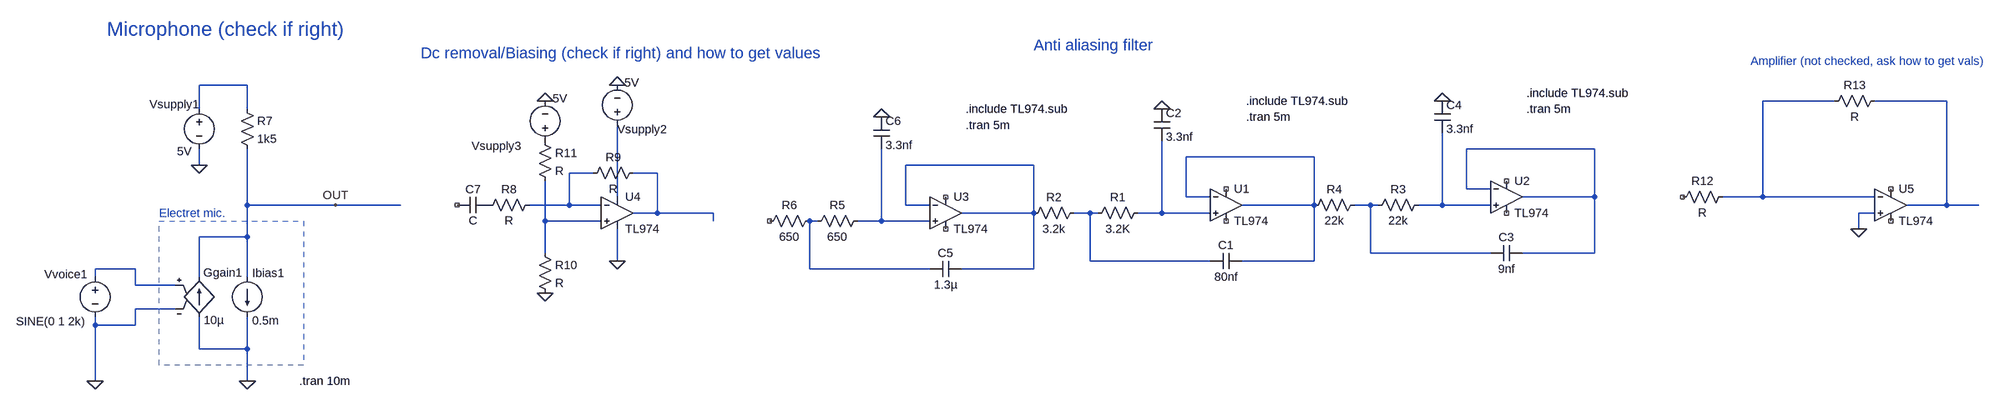
[diagram p0: schematic antialiasing.asc]
antialiasing.asc, the LTspice schematic file:
Version 4
SHEET 1 1660 680
WIRE -1888 -16 -1984 -16
WIRE 1312 16 1168 16
WIRE 1536 16 1392 16
WIRE -1984 32 -1984 -16
WIRE -1888 32 -1888 -16
WIRE 816 112 560 112
WIRE 256 128 0 128
WIRE -1984 144 -1984 112
WIRE -304 144 -560 144
WIRE -1184 160 -1232 160
WIRE -1056 160 -1104 160
WIRE 560 192 560 112
WIRE 608 192 560 192
WIRE -1136 208 -1136 64
WIRE 0 208 0 128
WIRE 48 208 0 208
WIRE 816 208 816 112
WIRE 816 208 672 208
WIRE 1168 208 1168 16
WIRE 1168 208 1088 208
WIRE 1392 208 1168 208
WIRE -1888 224 -1888 112
WIRE -1712 224 -1888 224
WIRE -1568 224 -1712 224
WIRE -1232 224 -1232 160
WIRE -1232 224 -1312 224
WIRE -1168 224 -1232 224
WIRE -560 224 -560 144
WIRE -512 224 -560 224
WIRE 256 224 256 128
WIRE 256 224 112 224
WIRE 368 224 336 224
WIRE 384 224 368 224
WIRE 512 224 512 80
WIRE 512 224 464 224
WIRE 608 224 512 224
WIRE 1536 224 1536 16
WIRE 1536 224 1456 224
WIRE 1600 224 1536 224
WIRE -1056 240 -1056 160
WIRE -1056 240 -1104 240
WIRE -944 240 -1056 240
WIRE -304 240 -304 144
WIRE -304 240 -448 240
WIRE -192 240 -224 240
WIRE -176 240 -192 240
WIRE -48 240 -48 96
WIRE -48 240 -96 240
WIRE 48 240 -48 240
WIRE 1392 240 1360 240
WIRE -1280 256 -1280 176
WIRE -1168 256 -1280 256
WIRE -944 256 -944 240
WIRE -736 256 -752 256
WIRE -608 256 -608 112
WIRE -608 256 -656 256
WIRE -512 256 -608 256
WIRE 1360 272 1360 240
WIRE -1888 288 -1888 224
WIRE -1888 288 -1984 288
WIRE -1280 320 -1280 256
WIRE 368 320 368 224
WIRE 608 320 368 320
WIRE 816 320 816 208
WIRE 816 320 672 320
WIRE -1136 336 -1136 272
WIRE -192 336 -192 240
WIRE 48 336 -192 336
WIRE 256 336 256 224
WIRE 256 336 112 336
WIRE -2112 352 -2192 352
WIRE -752 352 -752 256
WIRE -512 352 -752 352
WIRE -304 352 -304 240
WIRE -304 352 -448 352
WIRE -2192 368 -2192 352
WIRE -1984 368 -1984 288
WIRE -1888 368 -1888 288
WIRE -2112 384 -2112 352
WIRE -2032 384 -2112 384
WIRE -2032 432 -2112 432
WIRE -2192 464 -2192 448
WIRE -2112 464 -2112 432
WIRE -2112 464 -2192 464
WIRE -1984 512 -1984 448
WIRE -1888 512 -1888 448
WIRE -1888 512 -1984 512
WIRE -2192 576 -2192 464
WIRE -1888 576 -1888 512
FLAG -48 32 0
FLAG 512 16 0
FLAG -608 48 0
FLAG -1888 576 0
FLAG -1712 224 OUT
FLAG -2192 576 0
FLAG -1984 144 0
FLAG -1280 400 0
FLAG -1136 336 0
FLAG -1136 -16 0
FLAG -1280 16 0
FLAG 1360 272 0
SYMBOL Opamps\\opamp2 80 160 R0
SYMATTR InstName U1
SYMATTR Value TL974
SYMBOL res -80 224 R90
WINDOW 0 0 56 VBottom 2
WINDOW 3 32 56 VTop 2
SYMATTR InstName R1
SYMATTR Value 3.2K
SYMBOL res -208 224 R90
WINDOW 0 0 56 VBottom 2
WINDOW 3 32 56 VTop 2
SYMATTR InstName R2
SYMATTR Value 3.2k
SYMBOL cap 112 320 R90
WINDOW 0 0 32 VBottom 2
WINDOW 3 32 32 VTop 2
SYMATTR InstName C1
SYMATTR Value 80nf
SYMBOL cap -64 32 R0
SYMATTR InstName C2
SYMATTR Value 3.3nf
SYMBOL Opamps\\opamp2 640 144 R0
SYMATTR InstName U2
SYMATTR Value TL974
SYMBOL res 480 208 R90
WINDOW 0 0 56 VBottom 2
WINDOW 3 32 56 VTop 2
SYMATTR InstName R3
SYMATTR Value 22k
SYMBOL res 352 208 R90
WINDOW 0 0 56 VBottom 2
WINDOW 3 32 56 VTop 2
SYMATTR InstName R4
SYMATTR Value 22k
SYMBOL cap 672 304 R90
WINDOW 0 0 32 VBottom 2
WINDOW 3 32 32 VTop 2
SYMATTR InstName C3
SYMATTR Value 9nf
SYMBOL cap 496 16 R0
SYMATTR InstName C4
SYMATTR Value 3.3nf
SYMBOL Opamps\\opamp2 -480 176 R0
SYMATTR InstName U3
SYMATTR Value TL974
SYMBOL res -640 240 R90
WINDOW 0 0 56 VBottom 2
WINDOW 3 32 56 VTop 2
SYMATTR InstName R5
SYMATTR Value 650
SYMBOL cap -448 336 R90
WINDOW 0 0 32 VBottom 2
WINDOW 3 32 32 VTop 2
SYMATTR InstName C5
SYMATTR Value 1.3µ
SYMBOL cap -624 48 R0
SYMATTR InstName C6
SYMATTR Value 3.3nf
SYMBOL res -736 240 R90
WINDOW 0 0 56 VBottom 2
WINDOW 3 32 56 VTop 2
SYMATTR InstName R6
SYMATTR Value 650
SYMBOL g -1984 352 R0
WINDOW 0 8 7 Left 2
WINDOW 3 9 102 Left 2
SYMATTR InstName Ggain1
SYMATTR Value 10µ
SYMBOL current -1888 368 R0
WINDOW 0 10 -8 Left 2
WINDOW 3 10 87 Left 2
WINDOW 123 0 0 Left 0
WINDOW 39 0 0 Left 0
SYMATTR InstName Ibias1
SYMATTR Value 0.5m
SYMBOL res -1904 16 R0
SYMATTR InstName R7
SYMATTR Value 1k5
SYMBOL voltage -2192 352 R0
WINDOW 0 -101 11 Left 2
WINDOW 3 -158 105 Left 2
WINDOW 123 0 0 Left 0
WINDOW 39 0 0 Left 0
SYMATTR InstName Vvoice1
SYMATTR Value SINE(0 1 2k)
SYMBOL voltage -1984 16 R0
WINDOW 0 -99 7 Left 2
WINDOW 3 -44 101 Left 2
WINDOW 123 0 0 Left 0
WINDOW 39 0 0 Left 0
SYMATTR InstName Vsupply1
SYMATTR Value 5V
SYMBOL cap -1392 208 R90
WINDOW 0 0 32 VBottom 2
WINDOW 3 32 32 VTop 2
SYMATTR InstName C7
SYMBOL res -1296 208 R90
WINDOW 0 0 56 VBottom 2
WINDOW 3 32 56 VTop 2
SYMATTR InstName R8
SYMBOL Opamps\\opamp2 -1136 176 R0
SYMATTR InstName U4
SYMATTR Value TL974
SYMBOL res -1088 144 R90
WINDOW 0 0 56 VBottom 2
WINDOW 3 32 56 VTop 2
SYMATTR InstName R9
SYMBOL voltage -1136 80 R180
WINDOW 0 -99 7 Left 2
WINDOW 3 -44 101 Left 2
WINDOW 123 0 0 Left 0
WINDOW 39 0 0 Left 0
SYMATTR InstName Vsupply2
SYMATTR Value 5V
SYMBOL res -1296 304 R0
SYMATTR InstName R10
SYMBOL res -1296 80 R0
SYMATTR InstName R11
SYMBOL voltage -1280 112 R180
WINDOW 0 48 6 Left 2
WINDOW 3 -44 101 Left 2
WINDOW 123 0 0 Left 0
WINDOW 39 0 0 Left 0
SYMATTR InstName Vsupply3
SYMATTR Value 5V
SYMBOL res 1104 192 R90
WINDOW 0 0 56 VBottom 2
WINDOW 3 32 56 VTop 2
SYMATTR InstName R12
SYMBOL res 1408 0 R90
WINDOW 0 0 56 VBottom 2
WINDOW 3 32 56 VTop 2
SYMATTR InstName R13
SYMBOL Opamps\\opamp2 1424 160 R0
SYMATTR InstName U5
SYMATTR Value TL974
TEXT 120 16 Left 2 !.include TL974.sub
TEXT 120 48 Left 2 !.tran 5m
TEXT 680 0 Left 2 !.include TL974.sub
TEXT 680 32 Left 2 !.tran 5m
TEXT -440 32 Left 2 !.include TL974.sub
TEXT -440 64 Left 2 !.tran 5m
TEXT -1784 576 Left 2 !.tran 10m
TEXT -2064 240 Left 2 ;Electret mic.
TEXT -304 -96 Left 3 ;Anti aliasing filter
TEXT -2168 -128 Left 4 ;Microphone (check if right)
TEXT -1528 -80 Left 3 ;Dc removal/Biasing (check if right) and how to get values
TEXT 1144 -64 Left 2 ;Amplifier (not checked, ask how to get vals)
RECTANGLE Normal -1776 544 -2064 256 2

The netlist it stands for:
* antialiasing.asc
XU1 N013 N005 NC_01 NC_02 N005 TL974  ; pins In+ In- V+ V- OUT
R1 N013 N012 3.2K
R2 N012 N006 3.2k
C1 N005 N012 80nf
C2 0 N013 3.3nf
XU2 N011 N004 NC_03 NC_04 N004 TL974  ; pins In+ In- V+ V- OUT
R3 N011 N010 22k
R4 N010 N005 22k
C3 N004 N010 9nf
C4 0 N011 3.3nf
XU3 N016 N006 NC_05 NC_06 N006 TL974  ; pins In+ In- V+ V- OUT
R5 N016 N015 650
C5 N006 N015 1.3µ
C6 0 N016 3.3nf
R6 N015 NC_07 650
Ggain1 0 OUT N017 0 10µ
Ibias1 OUT 0 0.5m
R7 N001 OUT 1k5
Vvoice1 N017 0 SINE(0 1 2k)
Vsupply1 N001 0 5V
C7 P001 NC_08 C
R8 N007 P001 R
XU4 N014 N007 N009 0 N008 TL974  ; pins In+ In- V+ V- OUT
R9 N008 N007 R
Vsupply2 N009 0 5V
R10 N014 0 R
R11 P002 N014 R
Vsupply3 P002 0 5V
R12 N002 NC_09 R
R13 N003 N002 R
XU5 0 N002 NC_10 NC_11 N003 TL974  ; pins In+ In- V+ V- OUT
.include TL974.sub
.tran 5m
.include TL974.sub
.tran 5m
.include TL974.sub
.tran 5m
.tran 10m
* Electret mic.
* Anti aliasing filter
* Microphone (check if right)
* Dc removal/Biasing (check if right) and how to get values
* Amplifier (not checked, ask how to get vals)
.backanno
.end